# Altium schematic sheet Table of Contents Test Points.SchDoc
size A4; SheetNumber: 1; SheetTotal: 17
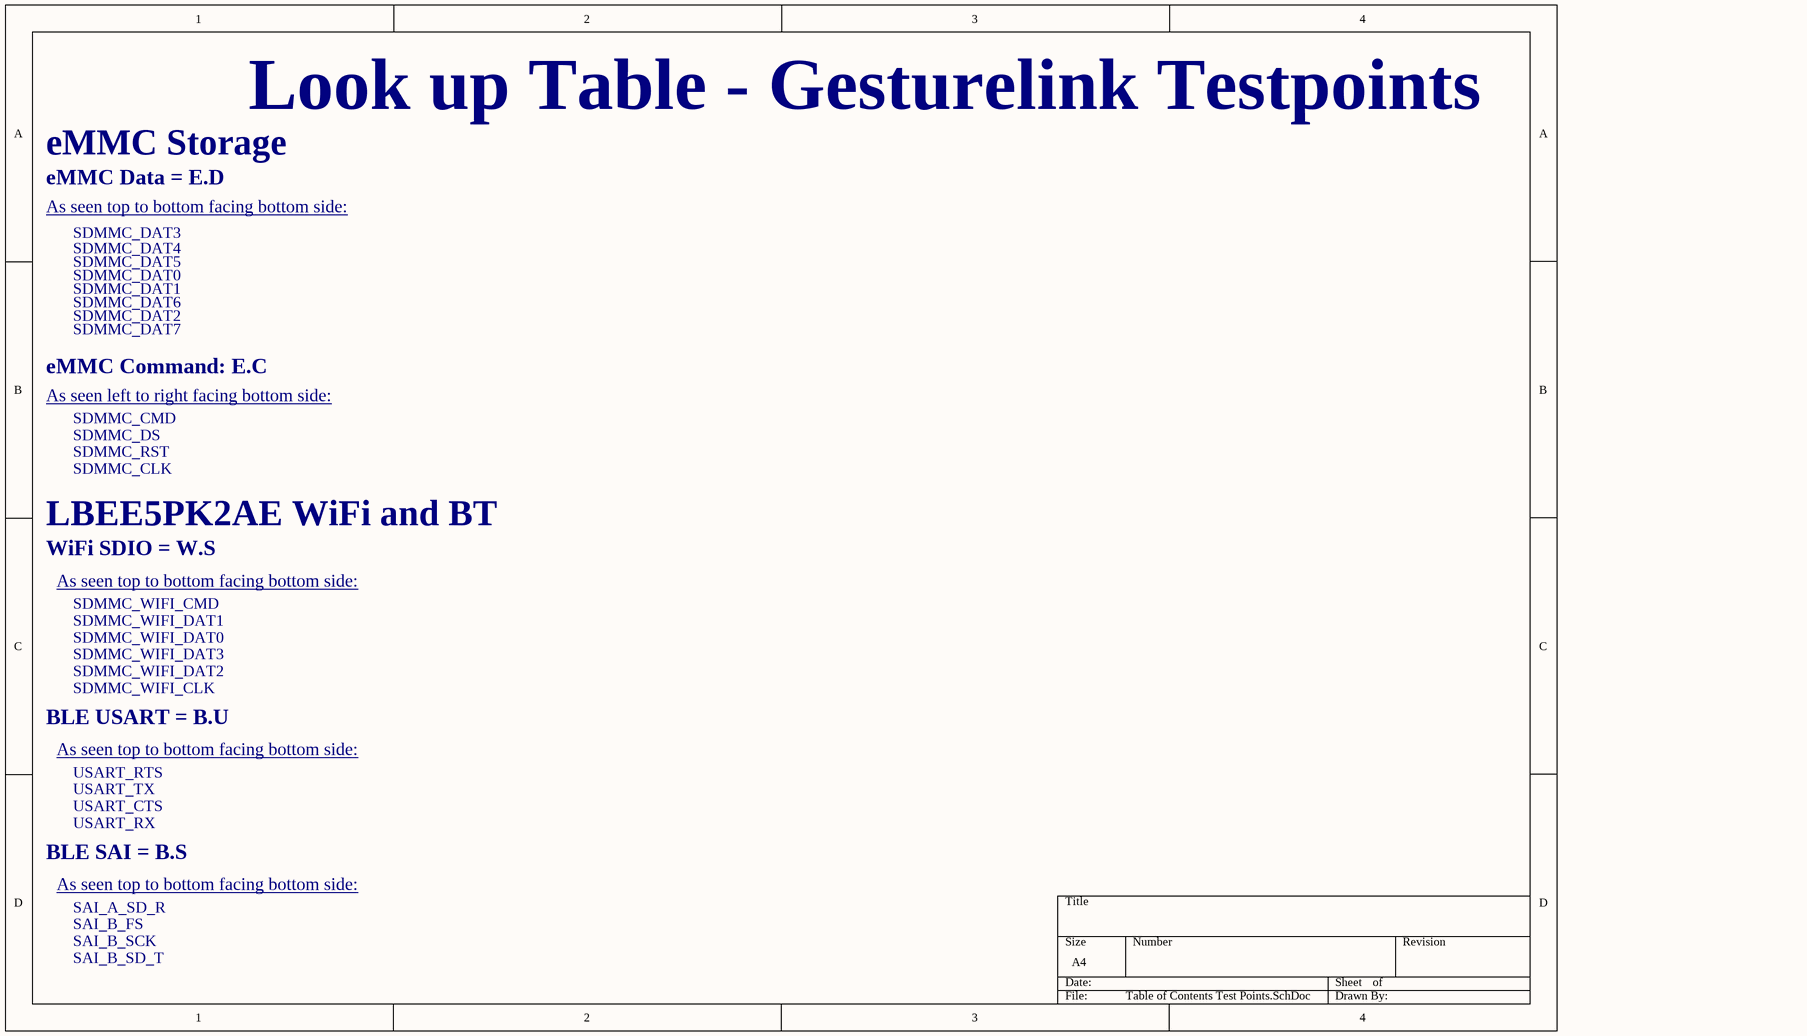
[diagram p0: Table of Contents Test Points.SchDoc]

## Notes on the sheet
- eMMC Storage
- Look up Table - Gesturelink Testpoints
- eMMC Data = E.D
- As seen top to bottom facing bottom side:
- SDMMC_DAT3
- SDMMC_DAT4
- SDMMC_DAT5
- SDMMC_DAT0
- SDMMC_DAT1
- SDMMC_DAT6
- eMMC Command: E.C
- SDMMC_DAT2
- SDMMC_DAT7
- As seen left to right facing bottom side:
- SDMMC_CMD
- SDMMC_DS
- SDMMC_RST
- SDMMC_CLK
- LBEE5PK2AE WiFi and BT
- WiFi SDIO = W.S
- SDMMC_WIFI_CMD
- SDMMC_WIFI_DAT1
- SDMMC_WIFI_DAT0
- SDMMC_WIFI_DAT3
- SDMMC_WIFI_DAT2
- SDMMC_WIFI_CLK
- BLE USART = B.U
- USART_RTS
- USART_TX
- USART_CTS
- USART_RX
- BLE SAI = B.S
- SAI_A_SD_R
- SAI_B_FS
- SAI_B_SCK
- SAI_B_SD_T